# Altium schematic sheet CTR-Charging-Base-Rev-A-Power-1.SchDoc: CTR Charging Base Board
size B; Author: RMG; Organization: OLogic, Inc.; DocumentNumber: CBB1; Revision: A; SheetNumber: 1; SheetTotal: 3; PageSetup: Record=PageOptions|CenterHorizontal=True|CenterVertical=True|PrintScale=0.70|XCorrection=1.00|YCorrection=1.00|PrintKind=0|BorderSize=5000000|LeftOffset=0|BottomOffset=0|Orientation=2|PaperLength=1000|PaperWidth=1000|Scale=100|PaperSource=15|PrintQuality=600|MediaType=1|DitherType=10|PrintScaleMode=1|PaperKind=Letter|PaperIndex=1
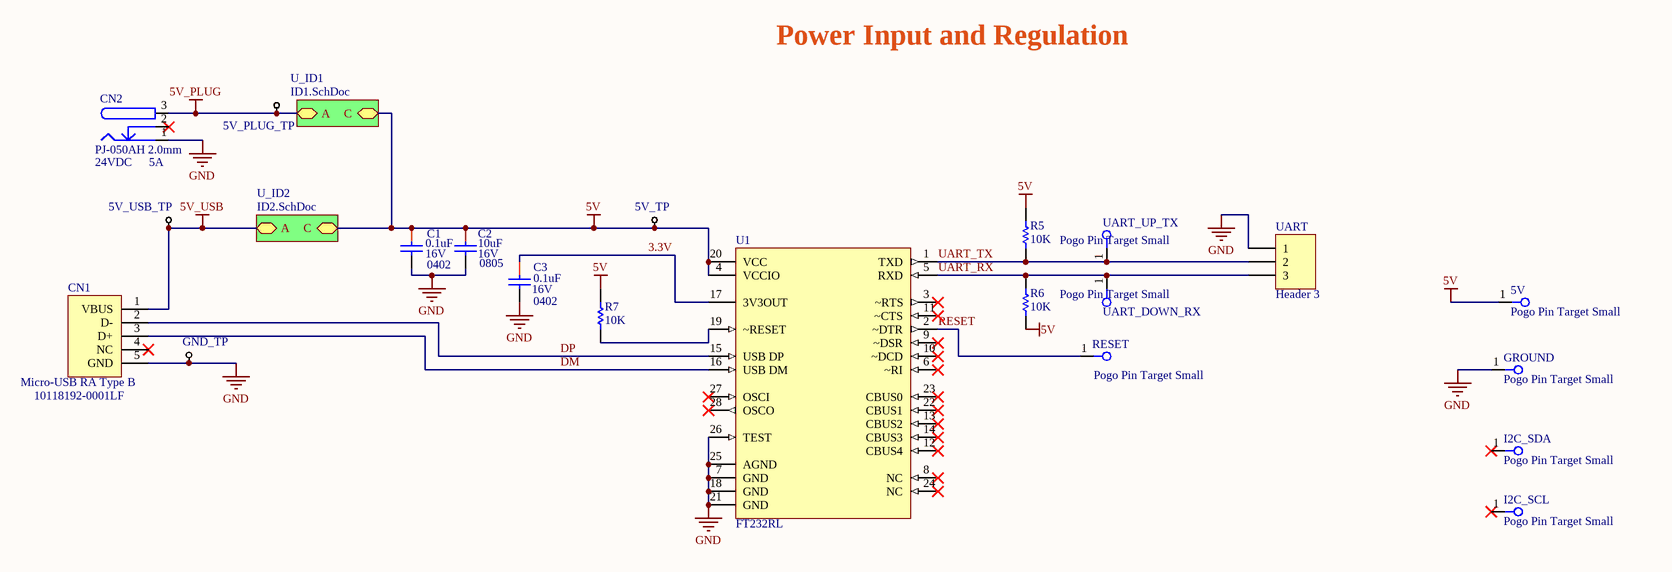
[diagram p0: CTR-Charging-Base-Rev-A-Power-1.SchDoc]

## Parts
5V  Pogo Pin Target Small  [CTR_POGO_PIN_TARGET_SMALL]
5V_PLUG_TP  Test Point  [TestPoint-TH 42 mil]  (value not drawn)  (no BOM)
5V_TP  Test Point  [TestPoint-TH 42 mil]  (value not drawn)  (no BOM)
5V_USB_TP  Test Point  [TestPoint-TH 42 mil]  (value not drawn)  (no BOM)
C1  0.1uF  Package / Case: 0402  Voltage - Rated: 16V  [CAPC0402(1005)_N]
C2  10uF  Voltage - Rated: 16V  Package / Case: 0805  [CAPC0805(2012)_L]
C3  0.1uF  Package / Case: 0402  Voltage - Rated: 16V  [CAPC0402(1005)_N]
CN1  Micro-USB RA Type B  Manufacturer Part Number 1: 10118192-0001LF  [USB-MICRO-B]
CN2  PJ-050AH 2.0mm  Voltage - Rated: 24VDC  Current Rating: 5A  [PJ-050AH]
GND_TP  Test Point  [TestPoint-TH 42 mil]  (value not drawn)  (no BOM)
GROUND  Pogo Pin Target Small  [CTR_POGO_PIN_TARGET_SMALL]
I2C_SCL  Pogo Pin Target Small  [CTR_POGO_PIN_TARGET_SMALL]
I2C_SDA  Pogo Pin Target Small  [CTR_POGO_PIN_TARGET_SMALL]
R5  10K  [RESC0603(1608)_N]
R6  10K  [RESC0603(1608)_N]
R7  10K  [RESC0603(1608)_N]
RESET  Pogo Pin Target Small  [CTR_POGO_PIN_TARGET_SMALL]
U1  FT232RL  [SSOP-28]
UART  Header 3  [HDR1X3]  (no BOM)
UART_DOWN_RX  Pogo Pin Target Small  [CTR_POGO_PIN_TARGET_SMALL]
UART_UP_TX  Pogo Pin Target Small  [CTR_POGO_PIN_TARGET_SMALL]

## Sub-sheets
U_ID1 = ID1.SchDoc: A, C
U_ID2 = ID2.SchDoc: A, C

## Nets
5V: 5V.1(A) 5V_TP.1 C1.1 C2.1 R5.2 R6.1 R7.2 U1.4(VCCIO) U1.20(VCC) ; sheet U_ID1/C, sheet U_ID2/C
5V_PLUG: 5V_PLUG_TP.1 CN2.3 ; sheet U_ID1/A
5V_USB: 5V_USB_TP.1 CN1.1(VBUS) ; sheet U_ID2/A
GND: C1.2 C2.2 C3.2 CN1.0 CN1.5(GND) CN2.1 CN2.4 GND_TP.1 GROUND.1(A) U1.7(GND) U1.18(GND) U1.21(GND) U1.25(AGND) U1.26(TEST) UART.1
3.3V: C3.1 U1.17(3V3OUT)
DM: CN1.3(D+) U1.16(USB_DM)
DP: CN1.2(D-) U1.15(USB_DP)
RESET: RESET.1(A) U1.2(~DTR)
UART_RX: R6.2 U1.5(RXD) UART.3 UART_DOWN_RX.1(A)
UART_TX: R5.1 U1.1(TXD) UART.2 UART_UP_TX.1(A)
NetR7_1: R7.1 U1.19(~RESET)

Not connected (* = marked no-connect by the designer): CN1 4(NC)*; CN2 2*; I2C_SCL 1(A)*; I2C_SDA 1(A)*; U1 3(~RTS)* 6(~RI)* 8(NC)* 9(~DSR)* 10(~DCD)* 11(~CTS)* 12(CBUS4)* 13(CBUS2)* 14(CBUS3)* 22(CBUS1)* 23(CBUS0)* 24(NC)* 27(OSCI)* 28(OSCO)*

## Notes on the sheet
- Power Input and Regulation
- Title
- By:
- Date:
- Number:
- Time:
- Revision:
- Sheet
- of
- OLogic, Inc.
- 1394 Borregas Ave.
- Sunnyvale, CA
- 94089 USA
- File:
- (650) 996-1490

## Library data of the parts
5V GROUND I2C_SCL I2C_SDA RESET UART_DOWN_RX UART_UP_TX = CTR Pogo Pin Target Small: Manufacturer Part Number 1: Small Target; Plating: Gold; Manufacturer 1: CTR; Category: Connectors, Interconnects; Part Status: Active; Material: Copper Alloy; Mounting Type: Through Hole; Supplier Unit Price 1: 0.131; Supplier 1: CTR; Supplier Part Number 1: Small Target; Supplier Stock 1: 9999999
5V_PLUG_TP 5V_TP 5V_USB_TP GND_TP = TestPoint, small
C1 C3 = CAP CER 0.1UF 16V 10% X5R 0402: 0.1uF 0402 16V; Manufacturer: Taiyo Yuden; Manufacturer Part Number: EMK105BJ104KV-F; Capacitance: 0.1µF; Tolerance: ±10%; Temperature Coefficient: X5R; Supplier 1: Digi-Key; RoHS: RoHS Compliant; Category: Capacitors; Stock 1: 590000; Pricing 1: 10000=0.0042, 20000=0.004, 30000=0.0038, 50000=0.0034 (USD); Packaging: Tape & Reel (TR); Mounting Type: Surface Mount, MLCC; Operating Temperature: -55°C ~ 85°C; Applications: General Purpose; Ratings: -; Size / Dimension: 0.039" L x 0.020" W (1.00mm x 0.50mm); Height - Seated (Max): -; Thickness (Max): 0.022" (0.55mm); Lead Spacing: -; Features: -; Lead Style: -; ComponentLink1URL: http://www.yuden.co.jp/or/product/category/capacitor/EMK105BJ104KV-F.pdf; ComponentLink1Description: http://www.yuden.co.jp/or/product/category/capacitor/EMK105BJ104KV-F.pdf; Supplier Part Number 1: 587-1226-2-ND
C2 = CAP CER 10UF 16V 10% X5R 0805: 10UF 0805 16V; Manufacturer: Murata Electronics North America; Manufacturer Part Number: GRM21BR61C106KE15L; Capacitance: 10µF; Tolerance: ±10%; Temperature Coefficient: X5R; Supplier 1: Digi-Key; RoHS: RoHS Compliant; Category: Capacitors; Stock 1: 1725870; Pricing 1: 1=0.25, 10=0.171, 50=0.1038, 100=0.0872, 250=0.07056, 500=0.06226, 1000=0.05291 (USD); Packaging: Cut Tape (CT); Mounting Type: Surface Mount, MLCC; Operating Temperature: -55°C ~ 85°C; Applications: General Purpose; Ratings: -; Size / Dimension: 0.079" L x 0.049" W (2.00mm x 1.25mm); Height - Seated (Max): -; Thickness (Max): 0.053" (1.35mm); Lead Spacing: -; Features: -; Lead Style: -; ComponentLink1URL: http://www.murata.com/products/catalog/pdf/c02e.pdf; ComponentLink1Description: http://www.murata.com/products/catalog/pdf/c02e.pdf; Supplier Part Number 1: 490-3886-1-ND
CN1 = Micro-USB-B: Manufacturer 1: FCI; Supplier Part Number 1: 609-4613-1-ND; Supplier 1: Digi-Key
CN2 = PJ-050AH: Power Barrel Connector Jack 2.00mm ID 5.50mm OD Through Hole, Right Angle; Manufacturer: CUI; Gender: Male; Plug/Mating Plug Diameter: 2.1mm ID, 5.5mm OD; Number of Positions/Contacts: 2 Conductors, 3 Contacts; Internal Switch(s): Single Switch, Normally Closed; Shielding: Unshielded; Supplier 1: Digikey; Manufacturer Part Number: PJ-050AH; Stock 1: 4408; Pricing 1: 1=0.78, 10=0.689, 25=0.648, 50=0.621, 100=0.594, 250=0.54, 500=0.486, 1000=0.432, 2500=0.3915 (USD); Category: Connectors, Interconnects; Family: Barrel - Power Connectors; Series: -; Connector Type: Jack; Mounting Type: Through Hole, Right Angle; Termination: Solder; Features: -; Color: Black; Contact Material: Copper; Contact Material - Plating: Nickel; Housing Color: Black; Housing Material: Thermoplastic; Operating Temperature: -25°C ~ 85°C; ComponentLink1URL: http://www.mouser.com/ds/2/670/PJ-050AH-524150.pdf; ComponentLink1Description: http://www.mouser.com/ds/2/670/PJ-050AH-524150.pdf; Supplier Part Number 1: CP-050AH-ND
R5-R7 = RES 10K OHM 1/10W 5% 0603 SMD: 10K 0603; Manufacturer: Panasonic Electronic Components; Manufacturer Part Number: ERJ-3GEYJ103V; Tolerance: ±5%; Power (Watts): 0.1W, 1/10W; Temperature Coefficient: ±200ppm/°C; Supplier 1: Digi-Key; RoHS: RoHS Compliant; Category: Resistors; Stock 1: 4724855; Pricing 1: 1=0.1, 50=0.0126, 100=0.0096, 250=0.00716, 500=0.00528, 1000=0.00352, 2500=0.00297 (USD); Packaging: Cut Tape (CT); Resistance (Ohms): 10k; Composition: Thick Film; Features: -; Package / Case: 0603 (1608 Metric); Supplier Device Package: 0603; Size / Dimension: 0.063" L x 0.031" W (1.60mm x 0.80mm); Height: 0.022" (0.55mm); Number of Terminations: 2; ComponentLink1URL: http://industrial.panasonic.com/www-cgi/jvcr13pz.cgi?E+PZ+3+AOA0001+ERJ3GEYJ103V+7+WW; ComponentLink1Description: http://industrial.panasonic.com/www-cgi/jvcr13pz.cgi?E+PZ+3+AOA0001+ERJ3GEYJ103V+7+WW; Supplier Part Number 1: P10KGCT-ND
U1 = FT232RL: USB Bridge, USB to UART USB 2.0 UART Interface 28-SSOP; Manufacturer: Future Technology Devices International (FTDI); Manufacturer Part Number: FT232RL-REEL; Number of Channels: 1; Transmit FIFO: 256Byte; Receive  FIFO: 128Byte; Interface Circuit Standard 1: RS-232/RS-422/RS-485; Transmitter and Receiver FIFO Counter: No; Operating Supply Voltage (Typ): 5V; Operating Supply Voltage (Max): 5.25V; Operating Supply Voltage (Min): 3.3V; Supply Current: 15(Typ)mA; Supplier 1: Digikey; Stock 1: 420192; Pricing 1: 1=4.5, 10=4.05, 100=3.65, 250=3.25, 500=2.85 (USD); Package Type: SSOP; Packaging: Tape and Reel; Mounting: Surface Mount; Pin Count: 28; Operating Temperature (Min): -40C; Operating Temperature (Max): 85C; Operating Temperature Classification: Industrial; ComponentLink1URL: https://datasheet.ciiva.com/34304/2161019-34304054.pdf; ComponentLink1Description: https://datasheet.ciiva.com/34304/2161019-34304054.pdf; ComponentLink2URL: https://datasheet.ciiva.com/1787/ds-ft232r-1787047.pdf; ComponentLink2Description: https://datasheet.ciiva.com/1787/ds-ft232r-1787047.pdf; ComponentLink3URL: https://datasheet.ciiva.com/1787/ds-ft232r-1787048.pdf; ComponentLink3Description: https://datasheet.ciiva.com/1787/ds-ft232r-1787048.pdf; ComponentLink4URL: https://datasheet.ciiva.com/1787/ds-ft232r-1787049.pdf; ComponentLink4Description: https://datasheet.ciiva.com/1787/ds-ft232r-1787049.pdf; ComponentLink5URL: https://datasheet.ciiva.com/4787/ds-ft232r-11534-4787658.pdf; ComponentLink5Description: https://datasheet.ciiva.com/4787/ds-ft232r-11534-4787658.pdf; ComponentLink6URL: https://datasheet.ciiva.com/15150/getdatasheetpartid-643207-15150506.pdf; ComponentLink6Description: https://datasheet.ciiva.com/15150/getdatasheetpartid-643207-15150506.pdf; ComponentLink7URL: https://datasheet.ciiva.com/16200/ds-ft232r-16200652.pdf; ComponentLink7Description: https://datasheet.ciiva.com/16200/ds-ft232r-16200652.pdf; ComponentLink8URL: https://datasheet.ciiva.com/26841/ft232rl-reel-26841080.pdf; ComponentLink8Description: https://datasheet.ciiva.com/26841/ft232rl-reel-26841080.pdf; Supplier Part Number 1: 768-1007-1-ND
UART = Header 3: Header, 3-Pin; Manufacturer: Sullins Connector Solutions; Manufacturer Part Number: PRPC003SAAN-RC; Connector Type: Header, Unshrouded, Breakaway; Number of Positions: 3; Number of Positions Loaded: All; Pitch: 0.100" (2.54mm); Supplier 1: Digi-Key; RoHS: RoHS Compliant; Category: Connectors, Interconnects; Stock 1: 0; Pricing 1: 1=0.18, 10=0.16, 100=0.132, 500=0.10438, 1000=0.0896, 5000=0.08174, 10000=0.0786 (USD); Packaging: Bulk; Contact Type: Male Pin; Number of Rows: 1; Row Spacing: -; Contact Mating Length: 0.230" (5.84mm); Mounting Type: Through Hole; Termination: Solder; Fastening Type: -; Features: -; Contact Finish: Gold; Contact Finish Thickness: Flash; Color: Black; ComponentLink1URL: http://media.digikey.com/PDF/Data%20Sheets/Sullins%20PDFs/xRxCzzzSxxN-RC_ST_11635-B.pdf; ComponentLink1Description: http://media.digikey.com/PDF/Data%20Sheets/Sullins%20PDFs/xRxCzzzSxxN-RC_ST_11635-B.pdf; Supplier Part Number 1: S1011EC-03-ND